# Altium schematic sheet Grupa2_sema.SchDoc: Zadatak 2
size A3; DrawnBy: Grupa 2; SheetNumber: 1; SheetTotal: 1; ProjectName: Zadatak 2
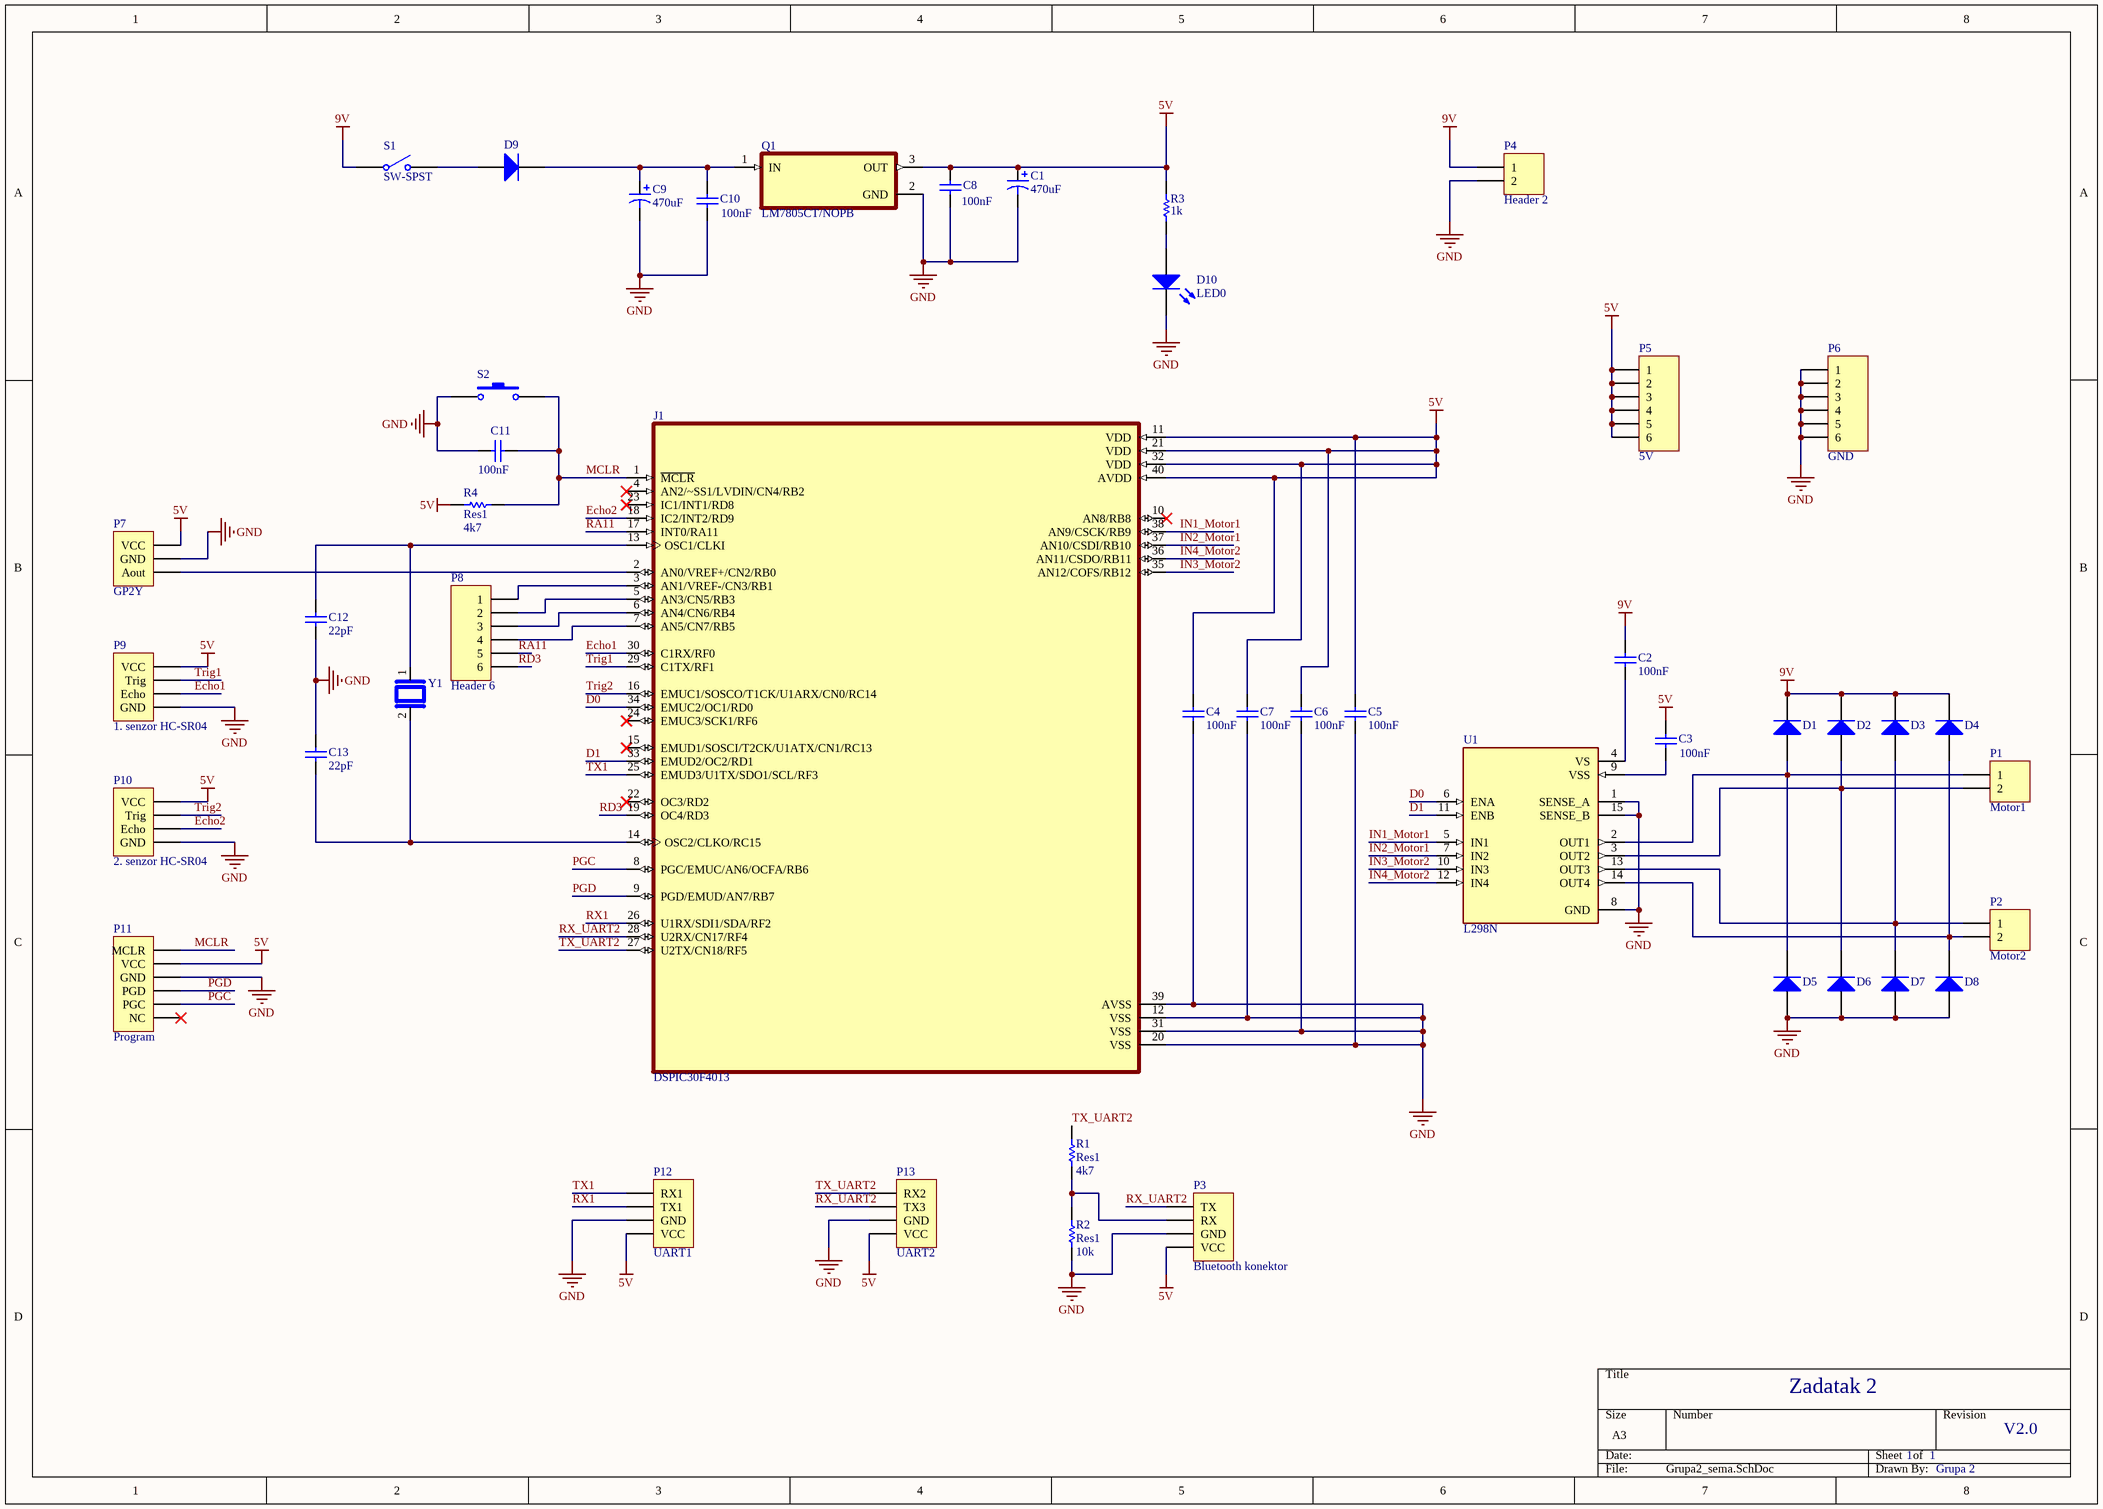
[diagram p0: Grupa2_sema.SchDoc]

## Parts
C1  value 470uF  [elektrolitski kondenzator]  (hidden comment: Cap Pol1)
C2  value 100nF  [RAD-0.1]  (hidden comment: Cap)
C3  value 100nF  [RAD-0.1]  (hidden comment: Cap)
C4  value 100nF  [RAD-0.1]  (hidden comment: Cap)
C5  value 100nF  [RAD-0.1]  (hidden comment: Cap)
C6  value 100nF  [RAD-0.1]  (hidden comment: Cap)
C7  value 100nF  [RAD-0.1]  (hidden comment: Cap)
C8  value 100nF  [RAD-0.1]  (hidden comment: Cap)
C9  value 470uF  [elektrolitski kondenzator]  (hidden comment: Cap Pol1)
C10  value 100nF  [RAD-0.1]  (hidden comment: Cap)
C11  value 100nF  [RAD-0.1]  (hidden comment: Cap)
C12  value 22pF  [RAD-0.1]  (hidden comment: Cap)
C13  value 22pF  [RAD-0.1]  (hidden comment: Cap)
D1  Diode 1N4001  [DO-41]  (value not drawn)
D2  Diode 1N4001  [DO-41]  (value not drawn)
D3  Diode 1N4001  [DO-41]  (value not drawn)
D4  Diode 1N4001  [DO-41]  (value not drawn)
D5  Diode 1N4001  [DO-41]  (value not drawn)
D6  Diode 1N4001  [DO-41]  (value not drawn)
D7  Diode 1N4001  [DO-41]  (value not drawn)
D8  Diode 1N4001  [DO-41]  (value not drawn)
D9  Diode 1N4001  [DO-41]  (value not drawn)
D10  LED0  [LED dioda]
J1  DSPIC30F4013  [PDIP40_600MC_MCH]
P1  Motor1  [HDR1X2]
P2  Motor2  [HDR1X2]
P3  Bluetooth konektor  [HDR1X4]
P4  Header 2  [HDR1X2]
P5  5V  [HDR1X6]
P6  GND  [HDR1X6]
P7  GP2Y  [HDR1X3]
P8  Header 6  [HDR1X6]
P9  1. senzor HC-SR04  [HDR1X4]
P10  2. senzor HC-SR04  [HDR1X4]
P11  Program  [HDR1X6]
P12  UART1  [HDR1X4]
P13  UART2  [HDR1X4]
Q1  LM7805CT/NOPB  [TO254P1054X470X1955-3]
R1  Res1  value 4k7  [AXIAL-0.3]
R2  Res1  value 10k  [AXIAL-0.3]
R3  value 1k  [AXIAL-0.3]  (hidden comment: Res1)
R4  Res1  value 4k7  [AXIAL-0.3]
S1  SW-SPST  [SPST-2]
S2  SW-PB  [SPST-2]  (value not drawn)
U1  L298N  [TO127P2020X500X2100-15]
Y1  HC-49/U-S16000000ABJB  [XTAL_HC49P488W43L1150T466H350]  (value not drawn)

## Nets
5V: C1.1 C3.1 C4.2 C5.2 C6.2 C7.2 C8.2 J1.11(VDD) J1.21(VDD) J1.32(VDD) J1.40(AVDD) P3.4(VCC) P5.1 P5.2 P5.3 P5.4 P5.5 P5.6 P7.1(VCC) P9.1(VCC) P10.1(VCC) P11.2(VCC) P12.4(VCC) P13.4(VCC) Q1.3(OUT) R3.2 R4.2
9V: C2.2 D1.2(K) D2.2(K) D3.2(K) D4.2(K) P4.1 S1.1(COMMON)
GND: C1.2 C4.1 C5.1 C6.1 C7.1 C8.1 C9.2 C10.1 C11.1 C12.1 C13.2 D5.1(A) D6.1(A) D7.1(A) D8.1(A) D10.2(K) J1.12(VSS) J1.20(VSS) J1.31(VSS) J1.39(AVSS) P3.3(GND) P4.2 P6.1 P6.2 P6.3 P6.4 P6.5 P6.6 P7.2(GND) P9.4(GND) P10.4(GND) P11.3(GND) P12.3(GND) P13.3(GND) Q1.2(GND) R2.1 S2.1 U1.1(SENSE_A) U1.8(GND) U1.15(SENSE_B)
D0: J1.34(EMUC2/OC1/RD0) U1.6(ENA)
D1: J1.33(EMUD2/OC2/RD1) U1.11(ENB)
Echo1: J1.30(C1RX/RF0) P9.3(Echo)
Echo2: J1.18(IC2/INT2/RD9) P10.3(Echo)
IN1_Motor1: J1.38(AN9/CSCK/RB9) U1.5(IN1)
IN2_Motor1: J1.37(AN10/CSDI/RB10) U1.7(IN2)
IN3_Motor2: J1.35(AN12/COFS/RB12) U1.10(IN3)
IN4_Motor2: J1.36(AN11/CSDO/RB11) U1.12(IN4)
MCLR: C11.2 J1.1(~{MCLR}) P11.1(MCLR) R4.1 S2.2
PGC: J1.8(PGC/EMUC/AN6/OCFA/RB6) P11.5(PGC)
PGD: J1.9(PGD/EMUD/AN7/RB7) P11.4(PGD)
RA11: J1.17(INT0/RA11) P8.5
RD3: J1.19(OC4/RD3) P8.6
RX1: J1.26(U1RX/SDI1/SDA/RF2) P12.2(TX1)
RX_UART2: J1.28(U2RX/CN17/RF4) P3.1(TX) P13.2(TX3)
Trig1: J1.29(C1TX/RF1) P9.2(Trig)
Trig2: J1.16(EMUC1/SOSCO/T1CK/U1ARX/CN0/RC14) P10.2(Trig)
TX1: J1.25(EMUD3/U1TX/SDO1/SCL/RF3) P12.1(RX1)
TX_UART2: J1.27(U2TX/CN18/RF5) P13.1(RX2) R1.2
NetC2_1: C2.1 U1.4(VS)
NetC3_2: C3.2 U1.9(VSS)
NetC9_1: C9.1 C10.2 D9.2(K) Q1.1(IN)
NetC12_2: C12.2 J1.13(OSC1/CLKI) Y1.1
NetC13_1: C13.1 J1.14(OSC2/CLKO/RC15) Y1.2
NetD1_1: D1.1(A) D5.2(K) P1.1 U1.2(OUT1)
NetD2_1: D2.1(A) D6.2(K) P1.2 U1.3(OUT2)
NetD3_1: D3.1(A) D7.2(K) P2.1 U1.13(OUT3)
NetD4_1: D4.1(A) D8.2(K) P2.2 U1.14(OUT4)
NetD9_1: D9.1(A) S1.2(NO)
NetD10_1: D10.1(A) R3.1
NetJ1_2: J1.2(AN0/VREF+/CN2/RB0) P7.3(Aout)
NetJ1_3: J1.3(AN1/VREF-/CN3/RB1) P8.1
NetJ1_5: J1.5(AN3/CN5/RB3) P8.2
NetJ1_6: J1.6(AN4/CN6/RB4) P8.3
NetJ1_7: J1.7(AN5/CN7/RB5) P8.4
NetP3_2: P3.2(RX) R1.1 R2.2

Not connected (* = marked no-connect by the designer): J1 4(AN2/~SS1/LVDIN/CN4/RB2)* 10(AN8/RB8)* 15(EMUD1/SOSCI/T2CK/U1ATX/CN1/RC13)* 22(OC3/RD2)* 23(IC1/INT1/RD8)* 24(EMUC3/SCK1/RF6)*; P11 6(NC)*

## Notes on the sheet
- V2.0

## Library data of the parts
C1 C9 = Cap Pol1: Polarized Capacitor (Radial); Published: 8-Jun-2000; LatestRevisionDate: 17-Jul-2002; LatestRevisionNote: Re-released for DXP Platform.; PackageReference: RB7.6-15; Publisher: Altium Limited; PackageDescription: Polarized Capacitor (Radial); 2 Leads
C2-C8 C10-C13 = Cap: Capacitor; Published: 8-Jun-2000; LatestRevisionDate: 17-Jul-2002; LatestRevisionNote: Re-released for DXP Platform.; PackageReference: RAD-0.3; Publisher: Altium Limited; PackageDescription: Radial Cap, Thru-Hole; 2 Leads; 0.3 in Pin Spacing
D1-D9 = Diode 1N4001: 1 Amp General Purpose Rectifier; Published: 8-Jun-2000; LatestRevisionDate: 17-Jul-2002; LatestRevisionNote: Re-released for DXP Platform.; DatasheetVersion: 1998; PackageVersion: Aug-1999; PackageReference: DO-41; Publisher: Altium Limited; PackageDescription: Diode, Axial; Body 5.2 x 2.7 mm (LxDia. max), Lead Dia. 0.86 mm (max); Code_JEDEC: DO-204-AL; ComponentLink1Description: Manufacturer Link; ComponentLink1URL: http://www.fairchildsemi.com/; ComponentLink2Description: Datasheet; ComponentLink2URL: http://www.fairchildsemi.com/ds/1N%2F1N4001.pdf
D10 = LED0: Typical INFRARED GaAs LED; Published: 8-Jun-2000; LatestRevisionDate: 08-Jul-2005; LatestRevisionNote: Mech Layer 1 removed.; PackageReference: LED-0; Publisher: Altium Limited; PackageDescription: LED; 2 Leads
J1 = DSPIC30F4013-30I/P: Digital Signal Processors, DSP, DSC General Purpose | Microchip Technology Inc. DSPIC30F4013-30I/P; SnapEDA_Link: https://www.snapeda.com/parts/DSPIC30F4013-30I/P/Microchip/view-part/?ref=snap; Package: DIP-40 Microchip; Value: *; MF: Microchip; MP: DSPIC30F4013-30I/P; Check_prices: https://www.snapeda.com/parts/DSPIC30F4013-30I/P/Microchip/view-part/?ref=eda
P1 P2 P4 = Header 2: Header, 2-Pin; LatestRevisionDate: 17-Jul-2002; LatestRevisionNote: Re-released for DXP Platform.; Publisher: Altium Limited
P3 P12 P13 = Header 4H: Header, 4-Pin, Right Angle; LatestRevisionDate: 17-Jul-2002; LatestRevisionNote: Re-released for DXP Platform.; Publisher: Altium Limited
P5 P6 P8 P11 = Header 6: Header, 6-Pin; LatestRevisionDate: 17-Jul-2002; LatestRevisionNote: Re-released for DXP Platform.; Publisher: Altium Limited
P7 = Header 3: Header, 3-Pin; LatestRevisionDate: 17-Jul-2002; LatestRevisionNote: Re-released for DXP Platform.; Publisher: Altium Limited
P9 P10 = Header 4: Header, 4-Pin; LatestRevisionDate: 17-Jul-2002; LatestRevisionNote: Re-released for DXP Platform.; Publisher: Altium Limited
Q1 = LM7805CT/NOPB: MF: {'manufacturer': u'Texas Instruments'}; Package: None; Price: None; Value: *; MP: LM7805CT/NOPB; Availability: Unavailable
R1-R4 = Res1: Resistor; Published: 8-Jun-2000; LatestRevisionDate: 17-Jul-2002; LatestRevisionNote: Re-released for DXP Platform.; PackageReference: AXIAL-0.3; Publisher: Altium Limited; PackageDescription: Axial Device, Thru-Hole; 2 Leads; 0.3 in Pin Spacing
S1 = SW-SPST: Single-Pole, Single-Throw Switch; Published: 24-Mar-1999; LatestRevisionDate: 17-Jul-2002; LatestRevisionNote: Re-released for DXP Platform.; PackageReference: SPST-2; Publisher: Altium Limited; PackageDescription: Switch; 2 Leads
S2 = SW-PB: Switch; Published: 24-Mar-1999; LatestRevisionDate: 17-Jul-2002; LatestRevisionNote: Re-released for DXP Platform.; PackageReference: SPST-2; Publisher: Altium Limited; PackageDescription: Switch; 2 Leads
U1 = L298N: Dual Full Bridge Motor Driver 15-Pin(15+Tab) MULTIWATT V Tube; MP: L298N; Availability: Unavailable; Package: None; Value: *; Price: None
Y1 = HC-49/U-S16000000ABJB: 16 MHz Â±30ppm Crystal 18pF 50 Ohms HC-49/US; MF: Citizen Finedevice; SnapEDA_Link: https://www.snapeda.com/parts/HC-49/U-S16000000ABJB/Citizen/view-part/?ref=snap; Package: HC-49/US Citizen Finetech Miyota; Value: *; MP: HC-49/U-S16000000ABJB; Check_prices: https://www.snapeda.com/parts/HC-49/U-S16000000ABJB/Citizen/view-part/?ref=eda